# Altium schematic sheet Comms.SchDoc
size A
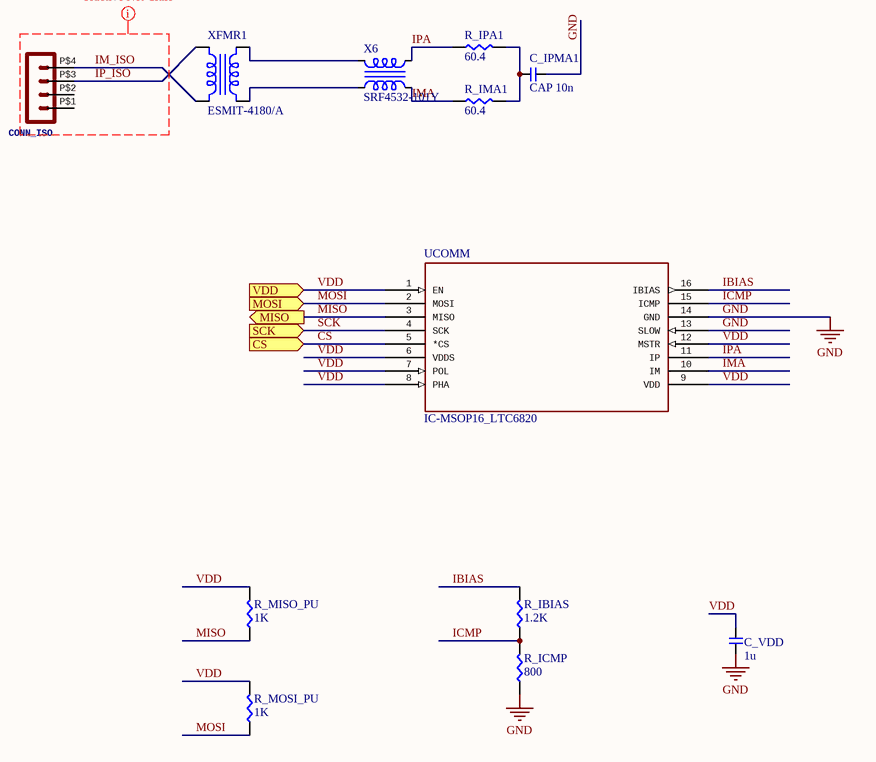
[diagram p0: Comms.SchDoc]

## Parts
C_IPMA1  CAP 10n  [CAP-0603]
C_VDD  1u  [CAP-0603]
CONN_ISO  Molex - Micro-Fit 3.0 Series connector,  3.00mm (0.118") pitch header, 4 positions.  [43650-0424]  (value not drawn)
R_IBIAS  1.2K  [RES-0603]
R_ICMP  800  [RES-0603]
R_IMA1  60.4  [RES-0603]
R_IPA1  60.4  [RES-0603]
R_MISO_PU  1K  [RES-0603]
R_MOSI_PU  1K  [RES-0603]
UCOMM  IC-MSOP16_LTC6820  [MSOP16]
X6  SRF4532-101Y  [SRF4532]
XFMR1  ESMIT-4180/A  [ISOXFMR_ESMIT4180]

## Ports
CS (in), MISO (out), MOSI (in), SCK (in), VDD (in)

## Nets
GND: C_IPMA1.1 C_VDD.1 R_ICMP.1 UCOMM.13(SLOW) UCOMM.14(GND)
CS: UCOMM.5(*CS) ; port CS
IBIAS: R_IBIAS.2 UCOMM.16(IBIAS)
ICMP: R_IBIAS.1 R_ICMP.2 UCOMM.15(ICMP)
IM_ISO: CONN_ISO.P$4 XFMR1.1
IMA: R_IMA1.2 UCOMM.10(IM) X6.1
IP_ISO: CONN_ISO.P$3 XFMR1.2
IPA: R_IPA1.2 UCOMM.11(IP) X6.4
MISO: R_MISO_PU.1 UCOMM.3(MISO) ; port MISO
MOSI: R_MOSI_PU.1 UCOMM.2(MOSI) ; port MOSI
SCK: UCOMM.4(SCK) ; port SCK
VDD: C_VDD.2 R_MISO_PU.2 R_MOSI_PU.2 UCOMM.1(EN) UCOMM.6(VDDS) UCOMM.7(POL) UCOMM.8(PHA) UCOMM.9(VDD) UCOMM.12(MSTR) ; port VDD
NetC_IPMA1_2: C_IPMA1.2 R_IMA1.1 R_IPA1.1
NetX6_2: X6.2 XFMR1.4
NetX6_3: X6.3 XFMR1.3

Not connected (* = marked no-connect by the designer): CONN_ISO P$1(1) P$2(2)

## Layout directives
net class Tractive: IM_ISO, IP_ISO

## Library data of the parts
C_IPMA1 C_VDD = CAP-0603
CONN_ISO = POS4_MF43650-0424: GateName_1: G$1; SymbolName_1: HEADER_POS4; DeviceSetName: HEADER_POS4_?; DeviceName: 43650-0424; LibraryName: MOLEX Micro-Fit; Package: 43650-0424
R_IBIAS R_ICMP R_IMA1 R_IPA1 R_MISO_PU R_MOSI_PU = RES-0603
X6 = CMC_SRF4532
XFMR1 = ISOXFMR_ESMIT4180